# EAGLE design 430BOOST_SENSE1_Rev1.2 (EAGLE 5.01)
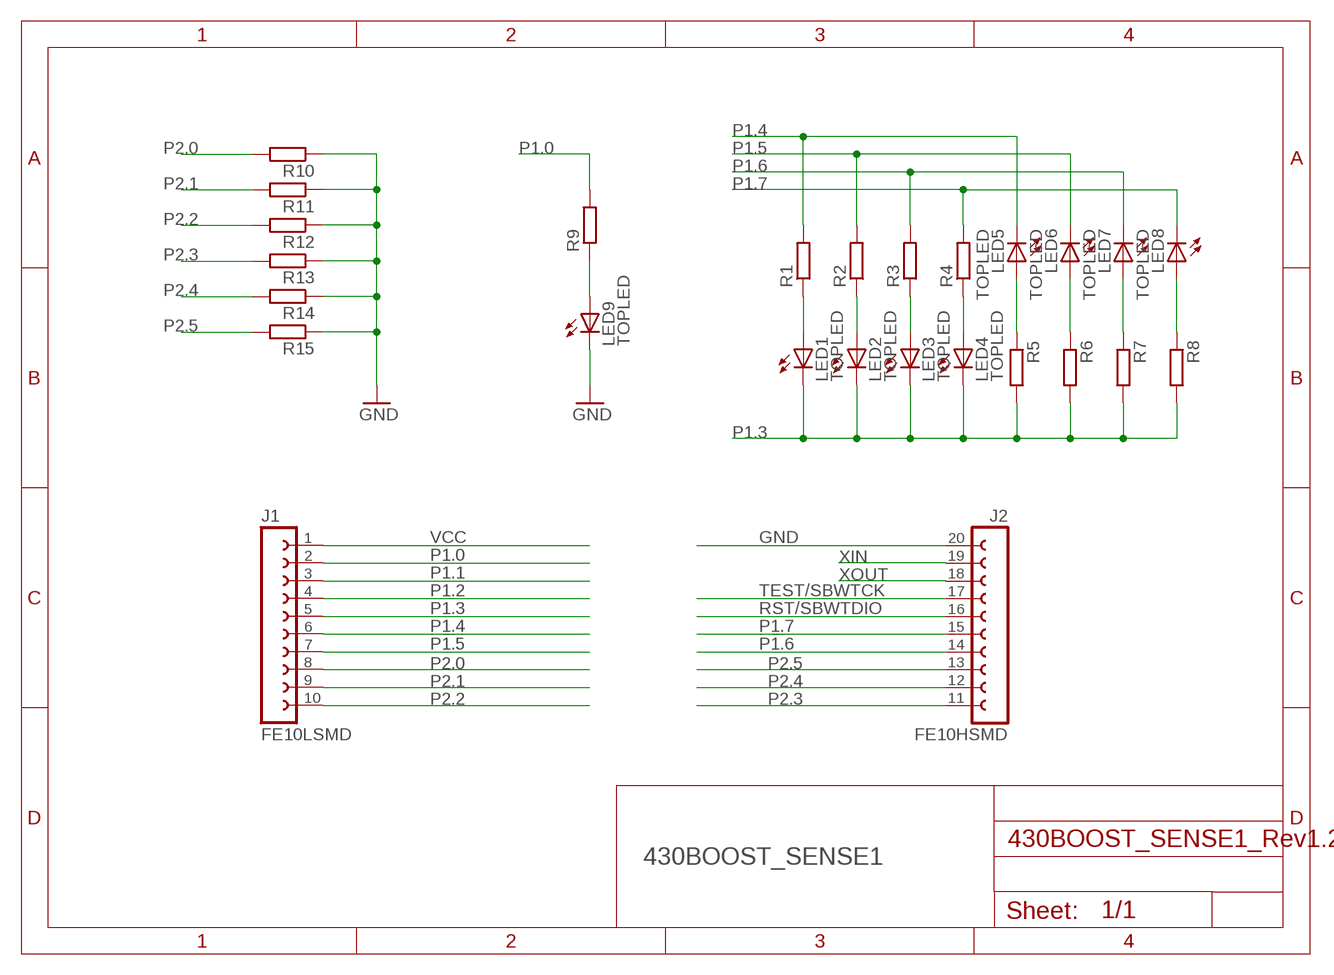
[diagram p0: schematic, sheet 1]

## Parts
J1  FE10LSMD  [FE10SMD]
J2  FE10HSMD  [FE10HSMD]
LED1  TOPLED  [MINI-TOPLED]
LED2  TOPLED  [MINI-TOPLED]
LED3  TOPLED  [MINI-TOPLED]
LED4  TOPLED  [MINI-TOPLED]
LED5  TOPLED  [MINI-TOPLED]
LED6  TOPLED  [MINI-TOPLED]
LED7  TOPLED  [MINI-TOPLED]
LED8  TOPLED  [MINI-TOPLED]
LED9  TOPLED  [MINI-TOPLED]
R1  R-EU_R0603  [R0603]
R2  R-EU_R0603  [R0603]
R3  R-EU_R0603  [R0603]
R4  R-EU_R0603  [R0603]
R5  R-EU_R0603  [R0603]
R6  R-EU_R0603  [R0603]
R7  R-EU_R0603  [R0603]
R8  R-EU_R0603  [R0603]
R9  R-EU_R0603  [R0603]
R10  R-EU_R0603  [R0603]
R11  R-EU_R0603  [R0603]
R12  R-EU_R0603  [R0603]
R13  R-EU_R0603  [R0603]
R14  R-EU_R0603  [R0603]
R15  R-EU_R0603  [R0603]

## Nets
GND [Ground]: J2.20 LED9.C R10.1 R11.1 R12.1 R13.1 R14.1 R15.1
N$1: LED1.A R1.1
N$2: LED2.A R2.1
N$3: LED3.A R3.1
N$4: LED4.A R4.1
N$5: LED5.A R5.1
N$6: LED6.A R6.1
N$7: LED7.A R7.1
N$8: LED8.A R8.1
N$10: LED9.A R9.1
P1.0: J1.2 R9.2
P1.1: J1.3
P1.2: J1.4
P1.3: J1.5 LED1.C LED2.C LED3.C LED4.C R5.2 R6.2 R7.2 R8.2
P1.4: J1.6 LED5.C R1.2
P1.5: J1.7 LED6.C R2.2
P1.6: J2.14 LED7.C R3.2
P1.7: J2.15 LED8.C R4.2
P2.0: J1.8 R10.2
P2.1: J1.9 R11.2
P2.2: J1.10 R12.2
P2.3: J2.11 R13.2
P2.4: J2.12 R14.2
P2.5: J2.13 R15.2
RST/SBWTDIO: J2.16
TEST/SBWTCK: J2.17
VCC: J1.1
XIN: J2.19
XOUT: J2.18

## Notes on the sheet
- 430BOOST_SENSE1

## Library data of the parts
J1 = LaunchPad:FE10LSMD
J2 = LaunchPad:FE10HSMD
LED1-LED9 = LaunchPad:TOPLED
R1-R15 = rcl:R-EU_: RESISTOR, European symbol

## Net classes
0 default: width 0.1 mm, drill 0.2 mm
1 Ground: width 0.1 mm, drill 0.2 mm

## Board
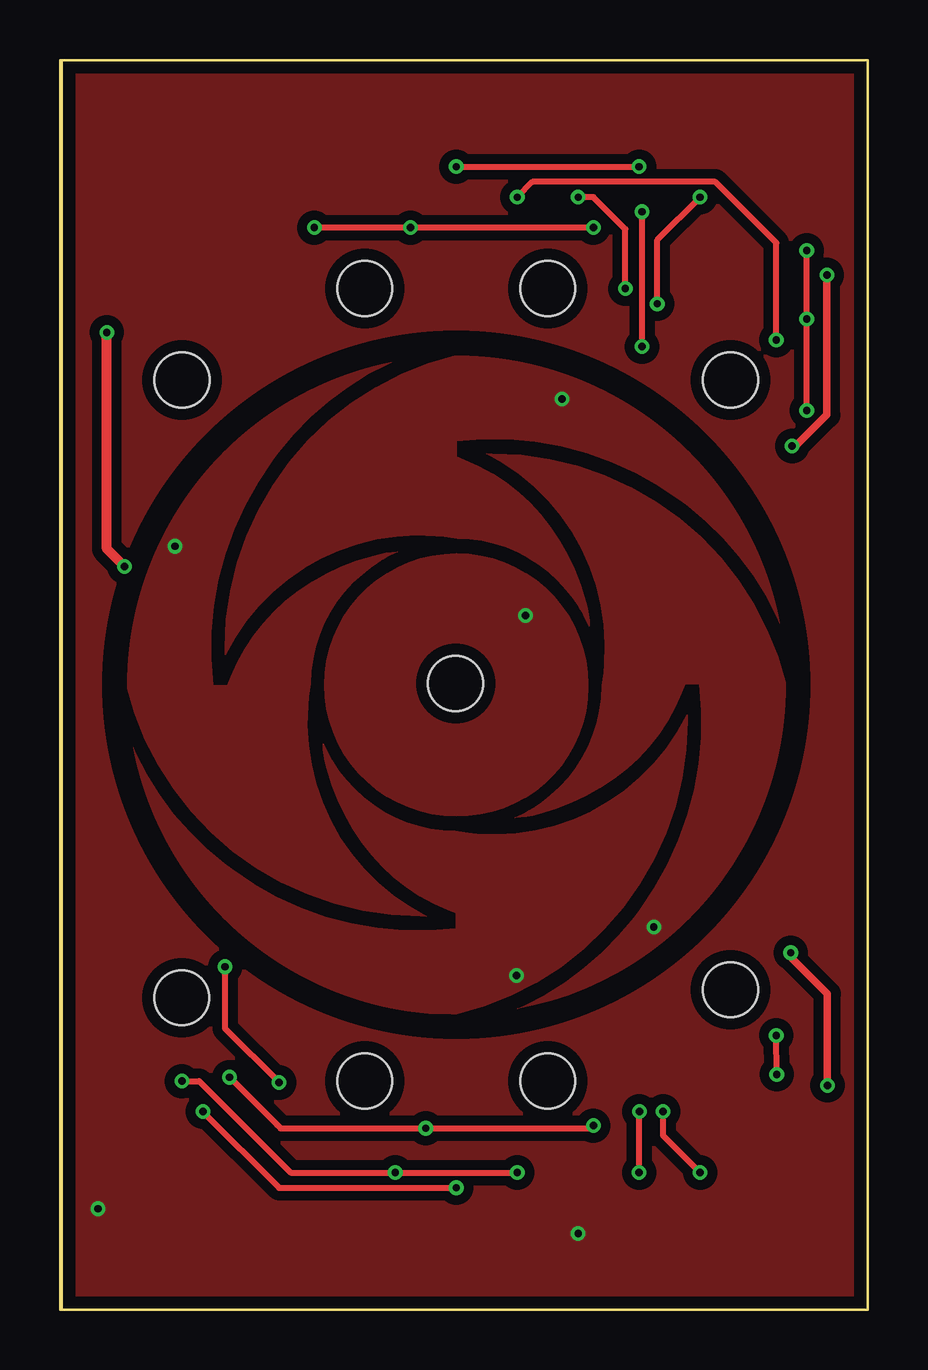
[diagram p1: board, top side]
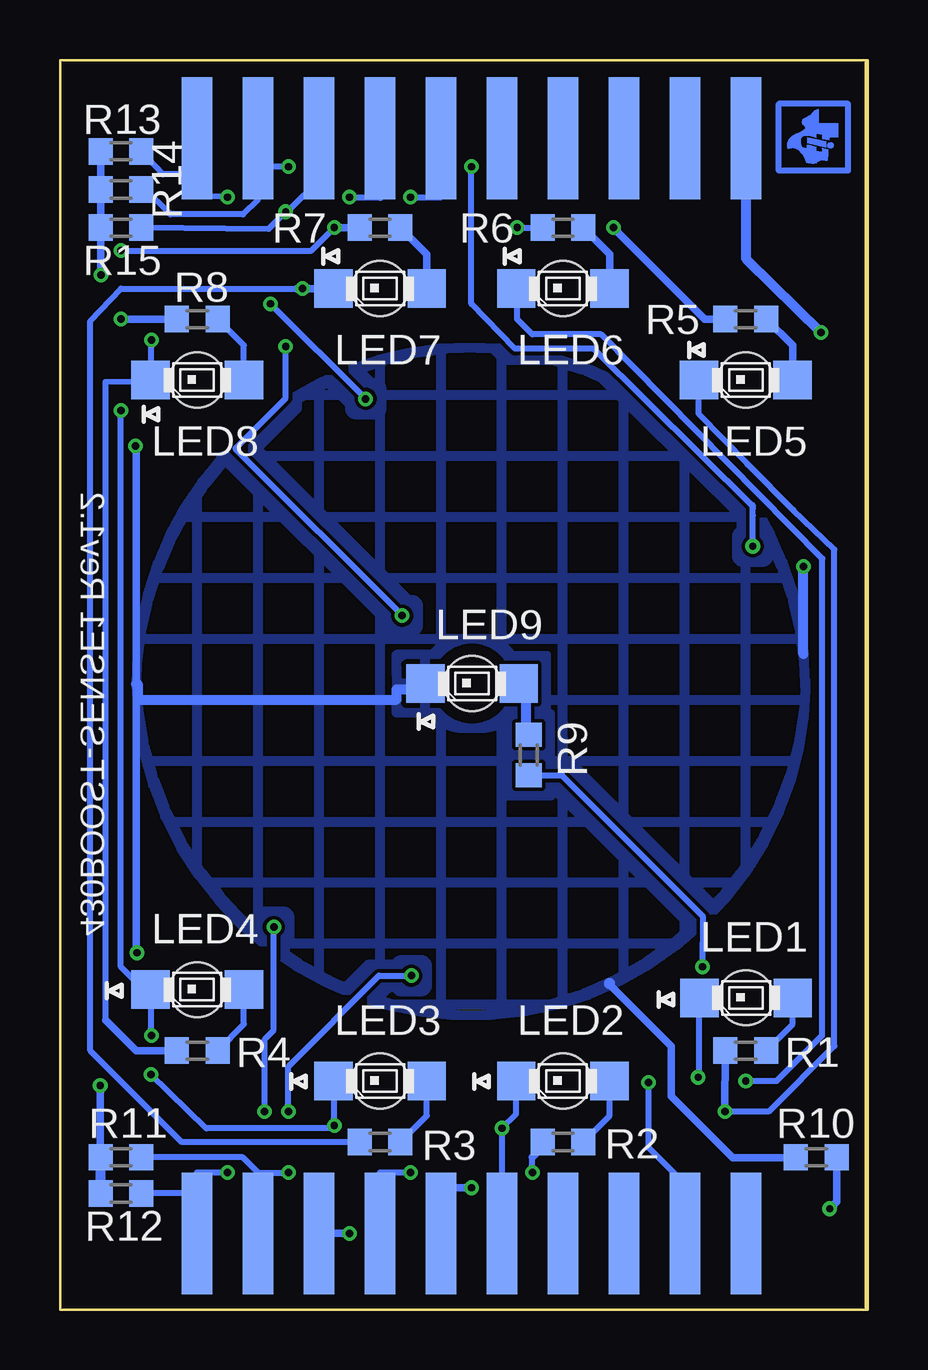
[diagram p2: board, bottom side, seen from below]

Size 33.66 x 52.07 mm. Coordinates in mm from the lower left corner, seen from the top.
Outline: 0.08,52.07 33.66,52.07 33.66,0 0,0 0,52.07 0.08,52.07
Outline: 0.08,52.07 0.08,0
Copper layers (1*16): Top 0.035mm / dielectric 1.5mm / Bottom 0.035mm
Design rules "PCB-POOL *": minimum track width 6mil, minimum drill 12mil, track to track 6mil, track to pad 6mil, pad to pad 6mil, via to via 6mil, smd to smd 6mil, copper to edge 20mil, drill to drill 8mil, minimum pad ring 6mil, minimum via ring 6mil, stop-mask expansion 3mil, vias tented up to drill 0mil, thermal gap 8mil
tRestrict: area 2.5,12 to 30.6,40.1

### Footprints (pad centres in the part's own frame; a part is rotated, then mirrored left to right if it is on the bottom)
FE10SMD = smd 1.27 x 5.08: 1 0,0; 2 2.54,0; 3 5.08,0; 4 7.62,0; 5 10.16,0; 6 12.7,0; 7 15.24,0; 8 17.78,0; 9 20.32,0; 10 22.86,0
FE10HSMD = smd 1.27 x 5.08: 11 0,0; 12 -2.54,0; 13 -5.08,0; 14 -7.62,0; 15 -10.16,0; 16 -12.7,0; 17 -15.24,0; 18 -17.78,0; 19 -20.32,0; 20 -22.86,0
MINI-TOPLED = smd 1.6 x 1.6: A 0,1.946; C 0,-1.946 | hole 2.286: 0,0
R0603 = smd 1 x 1.1: 1 -0.85,0; 2 0.85,0

### Placement (x,y rotation side)
J1  5.08,3.17 180 bottom
J2  27.94,48.82 180 bottom
LED1  5.07,12.99 270 bottom
LED2  12.7,9.53 270 bottom
LED3  20.32,9.53 270 bottom
LED4  27.94,13.34 270 bottom
LED5  5.08,38.73 270 bottom
LED6  12.7,42.55 270 bottom
LED7  20.32,42.54 270 bottom
LED8  27.94,38.73 270 bottom
LED9  16.48,26.09 270 bottom
R1  5.08,10.79 180 bottom
R2  12.7,6.98 180 bottom
R3  20.32,6.99 180 bottom
R4  27.94,10.79 180 bottom
R5  5.08,41.27 180 bottom
R6  12.7,45.09 180 bottom
R7  20.32,45.08 180 bottom
R8  27.94,41.27 180 bottom
R9  14.12,23.11 270 bottom
R10  2.14,6.35 0 bottom
R11  31.12,6.35 0 bottom
R12  31.11,4.84 0 bottom
R13  31.11,48.26 0 bottom
R14  31.12,46.67 0 bottom
R15  31.11,45.08 0 bottom
U$5  [TILOGO_SMALL]  2.02,48.74 270 bottom

### Tracks (layer width: path | path; a pad name or v marks a point on that pad's centre or on a via)
GND  (via drill 0.3, 0.3 pad 0.3)
  Top 0.305: v30.45,14.87 30.45,14.69 31.98,13.16 v31.98,9.35 | v31.95,43.11 31.95,37.29 30.66,35.99 v30.51,35.99 v30.5,35.99
  Top 0.406: v2.68,30.97 1.95,31.7 v1.95,40.72
  Bottom 0.254: 30.48,35.94 30.45,35.94 | 30.48,14.94 v30.45,14.87 | 18.62,26.09 LED9.C
  Bottom 0.305: 5.07,46.32 J2.20 | 2.9,6.45 R10.1 3.02,6.38 3.05,6.38 | 2.99,6.38 3.25,6.33 5.62,6.33 8.18,8.89 8.18,10.97 10.77,13.56 | 31.98,6.36 v31.98,9.35 | v31.95,43.11 R15.1 | R13.1 R14.1 R15.1 | 30.43,35.93 30.45,35.93 30.45,35.94 | R15.1 | 30.48,14.94 30.48,26.07 30.48,35.94 | v1.95,40.72
  Bottom 0.406: 5.07,46.32 5.07,43.82 4.99,43.7 v1.95,40.72 | 3.05,6.38 2.99,6.38 | 10.77,13.56 10.77,13.61 10.74,13.61 | R11.1 31.98,6.36 | R12.1 R11.1 | R11.1 | 30.43,35.93 30.53,35.96 v30.5,35.99 | 2.68,27.31 v2.68,30.97 | 18.96,26.09 18.62,26.09 | 18.96,26.09 18.96,26.03 18.9,26.03 | 30.48,26.07 30.42,26.07 30.42,25.42 19.63,25.42 19.63,25.85 18.9,25.85 18.9,26.09 | 18.9,26.09 | 18.9,26.09 18.96,26.09
  pour Bottom (hatched): 2.61,26.11 arc-90 16.59,40.09 arc-91 30.47,26.01 arc-179 2.57,26.18
N$1
  Bottom 0.254: R1.1 3.13,11.89 LED1.A
N$2
  Bottom 0.254: R2.1 10.75,8.09 LED2.A
N$3
  Bottom 0.254: R3.1 18.37,8.09 LED3.A
N$4
  Bottom 0.254: R4.1 25.99,11.89 LED4.A
N$5
  Bottom 0.305: R5.1 3.13,40.17 LED5.A
N$6
  Bottom 0.305: R6.1 10.75,43.98 LED6.A
N$7
  Bottom 0.305: R7.1 18.37,43.98 LED7.A
N$8
  Bottom 0.254: R8.1 25.99,40.17 LED8.A
N$10
  Bottom 0.406: R9.1 14.22,23.96 14.22,26.11 14.54,26.11 LED9.A
N$18
  Bottom 0.254: 3.7,47.46 3.7,50.24 0.81,50.24 0.81,47.46 3.7,47.46
P1.0  (via drill 0.3)
  Top 0.254: v9.13,9.47 6.88,11.71 v6.88,14.29
  Bottom 0.254: 7.62,5.24 9.13,6.75 v9.13,9.47 | v6.88,14.29 6.86,16.36 12.7,22.23 12.72,22.25 14.14,22.25 R9.2
  Bottom 0.305: J1.2 7.62,5.24 | J1.2
P1.3  (via drill 0.3)
  Top 0.254: v31.11,37.47 v31.11,41.27 v31.11,44.13 | v10.6,45.09 v14.61,45.09 22.3,45.09 | v22.23,7.67 22.05,7.56 v15.24,7.56 9.19,7.56 9.05,7.7 | v7.06,9.68 9.05,7.7 | 9.05,7.7 | v29.86,9.8 v29.84,11.43
  Top 0.305: v22.23,45.09 22.3,45.09
  Bottom 0.254: LED2.C 14.65,8.15 v15.24,7.56 J1.5 | v31.11,37.47 31.11,14.29 29.84,13.02 v29.84,11.43 | v22.23,45.09 23.18,44.13 v31.11,44.13 | v14.61,45.09 13.71,45.09 | LED3.C 22.27,9.49 22.23,9.45 v22.23,7.67 22.25,7.56 27.56,7.56 v29.86,9.8 | LED1.C 7.03,9.72 v7.06,9.68
  Bottom 0.305: 29.84,13.02 29.84,13.38 LED4.C | v31.11,41.27 R8.2 | R8.2 | v22.23,45.09 R7.2 | R5.2 5.91,41.27 6.78,41.27 v10.6,45.09 | 13.71,45.09 R6.2 | J1.5
P1.4  (via drill 0.3)
  Top 0.254: v5.95,8.26 9.13,5.08 v16.51,5.08
  Top 0.305: v5.95,8.26
  Bottom 0.254: v5.95,8.26 4.13,8.26 1.39,10.99 1.39,31.68 3.1,33.31 5,35.22 7.04,37.32 LED5.C
  Bottom 0.305: R1.2 5.93,10.82 v5.95,8.26 | v16.51,5.08 17.78,5.08 J1.6 | J1.6
P1.5  (via drill 0.3)
  Top 0.254: v5.08,9.53 5.79,9.53 9.6,5.71 v13.97,5.71 v19.05,5.71
  Bottom 0.254: v13.97,5.71 13.97,6.35 | v5.08,9.53 3.81,9.53 1.91,11.43 1.89,31.29 11.11,40.64 13.97,40.64 14.61,41.27 14.61,42.5 | v19.05,5.71 20.32,5.71 20.32,3.25
  Bottom 0.305: 13.97,6.35 13.55,6.77 R2.2 | 14.61,42.5 LED6.C | 20.32,3.25 J1.7
P1.6  (via drill 0.3)
  Top 0.254: v23.56,42.55 23.56,45.02 22.23,46.35 v21.59,46.35
  Bottom 0.254: R3.2 28.57,6.99 32.38,10.79 32.38,41.2 31.11,42.55 v23.56,42.55 | v21.59,46.35 20.32,46.35
  Bottom 0.305: 20.24,48.74 | 20.24,48.74 J2.14 | 20.32,46.35 20.24,46.43 20.24,48.74 | v23.56,42.55 LED7.C 23.81,42.55 v23.56,42.55
P1.7  (via drill 0.3)
  Top 0.254: v19.05,46.35 19.68,46.99 27.3,46.99 29.84,44.45 v29.84,40.4
  Bottom 0.254: 29.89,38.69 31.75,38.66 31.75,12.06 | J2.15 17.78,46.35 v19.05,46.35 | LED8.C 29.84,38.73 v29.84,40.4
  Bottom 0.305: 29.89,38.69 LED8.C | 31.75,12.06 30.48,10.79 R4.2 | R4.2
P2.0  (via drill 0.3, 0.3 pad 0.3)
  Bottom 0.305: v21.59,3.17 J1.8 | R10.2 1.29,4.5 v1.58,4.21
  pour Top (isolate 0.406, rank 2): 0,0 33.66,0 33.66,52.07 0,52.07
P2.1  (via drill 0.3)
  Top 0.254: v24.13,5.71 24.13,8.21 v24.14,8.26
  Bottom 0.254: 25.4,5.71 J1.9 25.4,5.71 | 25.4,5.71 v24.13,5.71 | 25.4,5.71 26.04,6.35 30.24,6.35 | 30.24,6.35 | 30.24,6.35 R11.2 | v24.14,8.26 24.14,10.12 20.37,13.92 v19.02,13.92
  pour Top: 26.14,24.79 26.14,24.52 arc-76 16.53,12.3 16.3,12.3 arc-25 10.9,13.48 arc-21 6.53,16.57 6.3,16.81 arc-17 4.44,19.43 4.19,19.91 4,20.3 3.86,20.62 arc-11 3.15,22.82 3,23.49 3.14,23.19 arc28 6.83,18.6 7.14,18.37 arc44 16.52,15.89 16.52,16.51 16.17,16.65 arc-28 13.01,18.93 arc-21 11.34,21.86 11.12,22.61 arc-14 10.96,23.58 10.96,23.59 11.19,23.12 11.27,22.98 11.36,22.84 11.43,22.72 11.62,22.44 11.91,22.09 arc50 16.46,19.95 17,19.87 17.37,19.84 arc68
P2.2  (via drill 0.3)
  Top 0.254: v26.67,5.71 25.13,7.25 v25.13,8.26
  Bottom 0.254: J1.10 | 27.94,4.45 J1.10 | 27.94,4.45 27.94,5.71 v26.67,5.71 | v25.13,8.26 25.12,8.28 25.12,11.28 24.75,11.64 24.75,14.63 | 27.94,4.45 28.02,4.45 28.02,4.84 R12.2 | v24.74,15.95 v24.75,15.94 24.75,14.63 | 24.75,14.63 24.75,14.62
  pour Top: 17.75,35.67 18.02,35.67 arc-76 30.24,26.06 30.24,25.83 arc-25 29.06,20.43 arc-21 25.97,16.06 25.73,15.83 arc-17 23.11,13.97 22.63,13.72 22.24,13.53 21.92,13.39 arc-11 19.72,12.68 19.05,12.53 19.35,12.67 arc28 23.94,16.36 24.17,16.67 arc44 26.65,26.05 26.03,26.05 25.89,25.7 arc-28 23.61,22.54 arc-21 20.68,20.87 19.93,20.65 arc-14 18.96,20.49 18.95,20.49 19.42,20.72 19.56,20.8 19.7,20.89 19.82,20.96 20.1,21.15 20.45,21.44 arc50 22.59,25.99 22.67,26.53 22.7,26.9 arc68
P2.3  (via drill 0.3)
  Top 0.254: v26.67,46.35 24.89,44.57 v24.89,41.91
  Bottom 0.254: v20.92,37.95 v24.89,41.91 | v26.67,46.35 27.94,46.43 27.94,48.18 | 27.94,48.18 J2.11 | R13.2 29.37,47.31 28.18,47.31 28.02,47.47 27.94,48.18
  pour Top: 6.88,27.28 6.88,27.55 arc-76 16.49,39.77 16.72,39.77 arc-25 22.12,38.59 arc-21 26.49,35.5 26.72,35.26 arc-17 28.58,32.64 28.83,32.16 29.02,31.77 29.16,31.45 arc-11 29.87,29.25 30.02,28.58 29.88,28.88 arc28 26.19,33.47 25.88,33.7 arc44 16.5,36.18 16.5,35.56 16.85,35.42 arc-28 20.01,33.14 arc-21 21.68,30.21 21.9,29.46 arc-14 22.06,28.49 22.06,28.48 21.83,28.95 21.75,29.09 21.66,29.23 21.59,29.35 21.4,29.63 21.11,29.98 arc50 16.56,32.12 16.02,32.2 15.65,32.23 arc68
P2.4  (via drill 0.3)
  Top 0.254: v16.51,47.62 v24.13,47.62
  Bottom 0.254: v24.13,47.62 25.09,47.62 | 25.09,47.62 J2.12 | v16.51,47.62 16.51,41.91 14.7,40.04 11.41,40.04 4.79,33.48 4.79,33.1 | R14.2 30.08,46.67 29.13,45.72 | 29.13,45.72 | 29.13,45.72 29.05,45.64 26.04,45.64 25.4,46.28 25.4,47.94 25.56,47.45 25.15,47.87 25.09,47.62 | 4.8,33.53 4.79,33.39 4.79,33.1 | v4.79,31.81 4.79,33.1
  pour Top: 15.27,16.4 15,16.4 arc-76 2.78,26.01 2.78,26.24 arc-25 3.96,31.64 arc-21 7.05,36.01 7.29,36.24 arc-17 9.91,38.1 10.39,38.35 11.1,38.68 arc-11 13.3,39.39 13.97,39.54 13.67,39.4 arc28 9.08,35.71 8.85,35.4 arc44 6.37,26.02 6.99,26.02 7.13,26.37 arc-28 9.41,29.53 arc-21 12.34,31.2 13.09,31.42 arc-14 14.06,31.58 14.07,31.58 13.6,31.35 13.46,31.27 13.32,31.18 13.2,31.11 12.92,30.92 12.57,30.63 arc50 10.43,26.08 10.35,25.54 10.32,25.17 arc68
P2.5  (via drill 0.3)
  Top 0.254: v24.25,40.13 v24.25,45.74
  Bottom 0.178: J2.13 22.86,48.26
  Bottom 0.254: 22.86,48.26 22.86,46.6 22.96,46.88 23.53,46.39 24.14,45.78 24.26,45.78 v24.25,45.74 24.34,45.66 24.97,45.02 R15.2 | v24.25,40.13 24.25,37.98 26.35,35.88 v19.4,28.93 v19.4,28.92
  pour Top: 16.51,31.51 16.53,31.51 arc-90 21.99,26.05 21.99,25.94 arc-91 16.51,20.56 16.5,20.56 arc-90 11.03,26.03 arc-90
XIN
  pour Top (isolate 0.406): -24.13,27.15 -24.13,27.15 arc-90

### Text on the board
bNames: 430BOOST-SENSE1 Rev1.2
Measures: 50.0 mm | 66.0 mm